# Altium project Fuel Cell Controller Board V1.PrjPcb
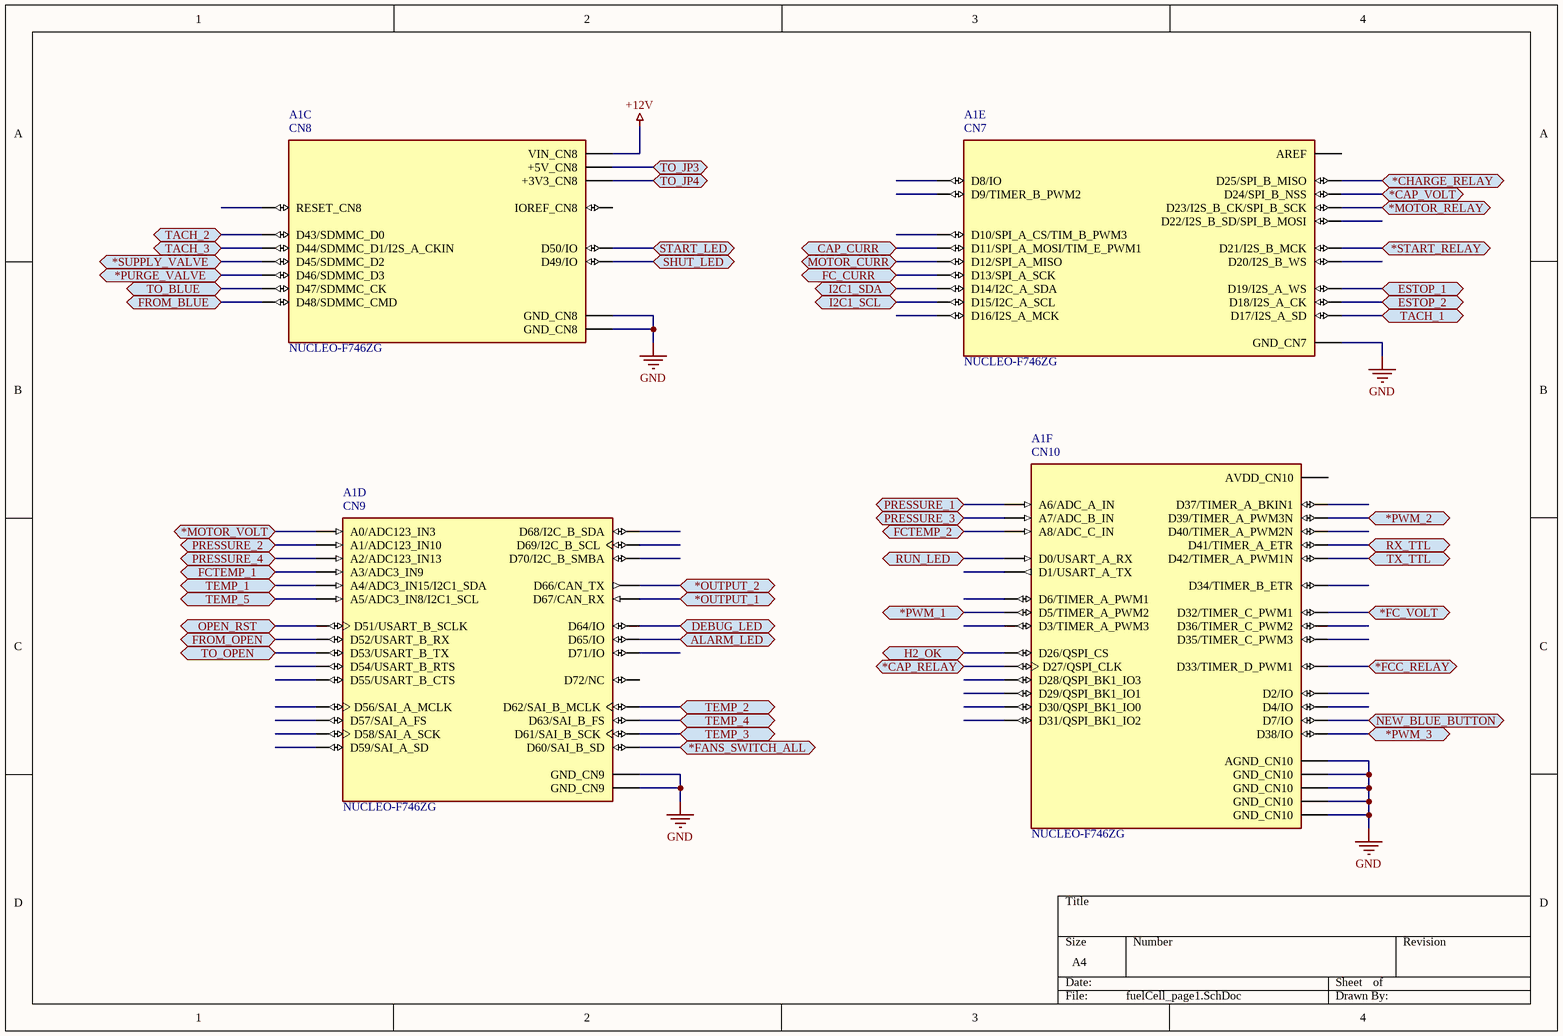
[diagram p0: fuelCell_page1.SchDoc]
2 sheets, 10 parts. Net scope: flat (ports and power ports of the same name join across sheets).
Sheets:
  fuelCell_page1.SchDoc
  fuelCell_page2.SchDoc

## Sheet fuelCell_page1.SchDoc
size A4; DrawnBy: Nicholas Semmens; SheetNumber: 1; SheetTotal: 2

### Parts
A1  NUCLEO-F746ZG  [MODULE_NUCLEO-F746ZG]  (parts C,D,E,F of 6)

### Ports
*CAP_RELAY (bidir), *CAP_VOLT (bidir), *CHARGE_RELAY (bidir), *FANS_SWITCH_ALL (bidir), *FC_VOLT (bidir), *FCC_RELAY (bidir), *MOTOR_RELAY (bidir), *MOTOR_VOLT (bidir), *OUTPUT_1 (bidir), *OUTPUT_2 (bidir), *PURGE_VALVE (bidir), *PWM_1 (bidir), *PWM_2 (bidir), *PWM_3 (bidir), *START_RELAY (bidir), *SUPPLY_VALVE (bidir), ALARM_LED (bidir), CAP_CURR (bidir), DEBUG_LED (bidir), ESTOP_1 (bidir), ESTOP_2 (bidir), FC_CURR (bidir), FCTEMP_1 (bidir), FCTEMP_2 (bidir), FROM_BLUE (bidir), FROM_OPEN (bidir), H2_OK (bidir), I2C1_SCL (bidir), I2C1_SDA (bidir), MOTOR_CURR (bidir), NEW_BLUE_BUTTON (bidir), OPEN_RST (bidir), PRESSURE_1 (bidir), PRESSURE_2 (bidir), PRESSURE_3 (bidir), PRESSURE_4 (bidir), RUN_LED (bidir), RX_TTL (bidir), SHUT_LED (bidir), START_LED (bidir), TACH_1 (bidir), TACH_2 (bidir), TACH_3 (bidir), TEMP_1 (bidir), TEMP_2 (bidir), TEMP_3 (bidir), TEMP_4 (bidir), TEMP_5 (bidir), TO_BLUE (bidir), TO_JP3 (bidir), TO_JP4 (bidir), TO_OPEN (bidir), TX_TTL (bidir)

### Nets
+12V: A1.CN8_15(VIN_CN8)
GND: A1.CN7_8(GND_CN7) A1.CN8_11(GND_CN8) A1.CN8_13(GND_CN8) A1.CN9_12(GND_CN9) A1.CN9_23(GND_CN9) A1.CN10_3(AGND_CN10) A1.CN10_5(GND_CN10) A1.CN10_17(GND_CN10) A1.CN10_22(GND_CN10) A1.CN10_27(GND_CN10)
NetA1_CN7_2: A1.CN7_2(D15/I2C_A_SCL) ; port I2C1_SCL
NetA1_CN7_3: A1.CN7_3(D17/I2S_A_SD) ; port TACH_1
NetA1_CN7_4: A1.CN7_4(D14/I2C_A_SDA) ; port I2C1_SDA
NetA1_CN7_5: A1.CN7_5(D18/I2S_A_CK) ; port ESTOP_2
NetA1_CN7_7: A1.CN7_7(D19/I2S_A_WS) ; port ESTOP_1
NetA1_CN7_10: A1.CN7_10(D13/SPI_A_SCK) ; port FC_CURR
NetA1_CN7_11: A1.CN7_11(D21/I2S_B_MCK) ; port *START_RELAY
NetA1_CN7_12: A1.CN7_12(D12/SPI_A_MISO) ; port MOTOR_CURR
NetA1_CN7_14: A1.CN7_14(D11/SPI_A_MOSI/TIM_E_PWM1) ; port CAP_CURR
NetA1_CN7_15: A1.CN7_15(D23/I2S_B_CK/SPI_B_SCK) ; port *MOTOR_RELAY
NetA1_CN7_17: A1.CN7_17(D24/SPI_B_NSS) ; port *CAP_VOLT
NetA1_CN7_19: A1.CN7_19(D25/SPI_B_MISO) ; port *CHARGE_RELAY
NetA1_CN8_2: A1.CN8_2(D43/SDMMC_D0) ; port TACH_2
NetA1_CN8_4: A1.CN8_4(D44/SDMMC_D1/I2S_A_CKIN) ; port TACH_3
NetA1_CN8_6: A1.CN8_6(D45/SDMMC_D2) ; port *SUPPLY_VALVE
NetA1_CN8_7: A1.CN8_7(+3V3_CN8) ; port TO_JP4
NetA1_CN8_8: A1.CN8_8(D46/SDMMC_D3) ; port *PURGE_VALVE
NetA1_CN8_9: A1.CN8_9(+5V_CN8) ; port TO_JP3
NetA1_CN8_10: A1.CN8_10(D47/SDMMC_CK) ; port TO_BLUE
NetA1_CN8_12: A1.CN8_12(D48/SDMMC_CMD) ; port FROM_BLUE
NetA1_CN8_14: A1.CN8_14(D49/IO) ; port SHUT_LED
NetA1_CN8_16: A1.CN8_16(D50/IO) ; port START_LED
NetA1_CN9_1: A1.CN9_1(A0/ADC123_IN3) ; port *MOTOR_VOLT
NetA1_CN9_2: A1.CN9_2(D51/USART_B_SCLK) ; port OPEN_RST
NetA1_CN9_3: A1.CN9_3(A1/ADC123_IN10) ; port PRESSURE_2
NetA1_CN9_4: A1.CN9_4(D52/USART_B_RX) ; port FROM_OPEN
NetA1_CN9_5: A1.CN9_5(A2/ADC123_IN13) ; port PRESSURE_4
NetA1_CN9_6: A1.CN9_6(D53/USART_B_TX) ; port TO_OPEN
NetA1_CN9_7: A1.CN9_7(A3/ADC3_IN9) ; port FCTEMP_1
NetA1_CN9_9: A1.CN9_9(A4/ADC3_IN15/I2C1_SDA) ; port TEMP_1
NetA1_CN9_11: A1.CN9_11(A5/ADC3_IN8/I2C1_SCL) ; port TEMP_5
NetA1_CN9_22: A1.CN9_22(D60/SAI_B_SD) ; port *FANS_SWITCH_ALL
NetA1_CN9_24: A1.CN9_24(D61/SAI_B_SCK) ; port TEMP_3
NetA1_CN9_25: A1.CN9_25(D67/CAN_RX) ; port *OUTPUT_1
NetA1_CN9_26: A1.CN9_26(D62/SAI_B_MCLK) ; port TEMP_2
NetA1_CN9_27: A1.CN9_27(D66/CAN_TX) ; port *OUTPUT_2
NetA1_CN9_28: A1.CN9_28(D63/SAI_B_FS) ; port TEMP_4
NetA1_CN9_29: A1.CN9_29(D65/IO) ; port ALARM_LED
NetA1_CN9_30: A1.CN9_30(D64/IO) ; port DEBUG_LED
NetA1_CN10_2: A1.CN10_2(D7/IO) ; port NEW_BLUE_BUTTON
NetA1_CN10_6: A1.CN10_6(D5/TIMER_A_PWM2) ; port *PWM_1
NetA1_CN10_7: A1.CN10_7(A6/ADC_A_IN) ; port PRESSURE_1
NetA1_CN10_9: A1.CN10_9(A7/ADC_B_IN) ; port PRESSURE_3
NetA1_CN10_11: A1.CN10_11(A8/ADC_C_IN) ; port FCTEMP_2
NetA1_CN10_13: A1.CN10_13(D26/QSPI_CS) ; port H2_OK
NetA1_CN10_15: A1.CN10_15(D27/QSPI_CLK) ; port *CAP_RELAY
NetA1_CN10_16: A1.CN10_16(D0/USART_A_RX) ; port RUN_LED
NetA1_CN10_18: A1.CN10_18(D42/TIMER_A_PWM1N) ; port TX_TTL
NetA1_CN10_20: A1.CN10_20(D41/TIMER_A_ETR) ; port RX_TTL
NetA1_CN10_26: A1.CN10_26(D39/TIMER_A_PWM3N) ; port *PWM_2
NetA1_CN10_28: A1.CN10_28(D38/IO) ; port *PWM_3
NetA1_CN10_29: A1.CN10_29(D32/TIMER_C_PWM1) ; port *FC_VOLT
NetA1_CN10_31: A1.CN10_31(D33/TIMER_D_PWM1) ; port *FCC_RELAY

Not connected (* = marked no-connect by the designer): A1 CN7_1(D16/I2S_A_MCK) CN7_6(AREF) CN7_9(D20/I2S_B_WS) CN7_13(D22/I2S_B_SD/SPI_B_MOSI) CN7_16(D10/SPI_A_CS/TIM_B_PWM3) CN7_18(D9/TIMER_B_PWM2) CN7_20(D8/IO) CN8_3(IOREF_CN8) CN8_5(RESET_CN8) CN9_8(D54/USART_B_RTS) CN9_10(D55/USART_B_CTS) CN9_13(D72/NC) CN9_14(D56/SAI_A_MCLK) CN9_15(D71/IO) CN9_16(D57/SAI_A_FS) CN9_17(D70/I2C_B_SMBA) CN9_18(D58/SAI_A_SCK) CN9_19(D69/I2C_B_SCL) CN9_20(D59/SAI_A_SD) CN9_21(D68/I2C_B_SDA) CN10_1(AVDD_CN10) CN10_4(D6/TIMER_A_PWM1) CN10_8(D4/IO) CN10_10(D3/TIMER_A_PWM3) CN10_12(D2/IO) CN10_14(D1/USART_A_TX) CN10_19(D28/QSPI_BK1_IO3) CN10_21(D29/QSPI_BK1_IO1) CN10_23(D30/QSPI_BK1_IO0) CN10_24(D40/TIMER_A_PWM2N) CN10_25(D31/QSPI_BK1_IO2) CN10_30(D37/TIMER_A_BKIN1) CN10_32(D36/TIMER_C_PWM2) CN10_33(D34/TIMER_B_ETR) CN10_34(D35/TIMER_C_PWM3)

### Notes on the sheet
- (in symbol NUCLEO-F746ZG, part C) CN8
- (in symbol NUCLEO-F746ZG, part D) CN9
- (in symbol NUCLEO-F746ZG, part E) CN7
- (in symbol NUCLEO-F746ZG, part F) CN10

### Library data of the parts
A1 = NUCLEO-F746ZG: STM32F746ZG, mbed-Enabled Development Nucleo-144 STM32F7 ARMÂ® CortexÂ®-M7 MCU 32-Bit Embedded Evaluation Board; MF: STMicroelectronics; SnapEDA_Link: https://www.snapeda.com/parts/NUCLEO-F746ZG/STMicroelectronics/view-part/531935/?ref=snap; Price: None; Check_prices: https://www.snapeda.com/parts/NUCLEO-F746ZG/STMicroelectronics/view-part/531935/?ref=eda; Value: *; Package: None; Availability: Warning; Purchase-URL: https://pricing.snapeda.com/search/part/NUCLEO-F746ZG/?ref=eda; MP: NUCLEO-F746ZG

## Sheet fuelCell_page2.SchDoc
size A4; SheetNumber: 2; SheetTotal: 2
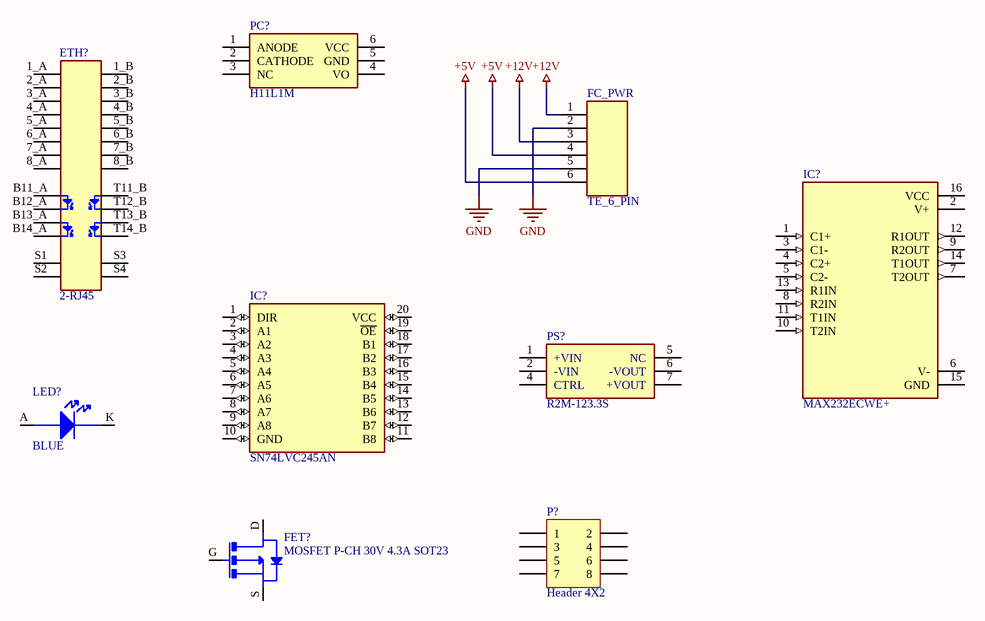
[diagram p1: fuelCell_page2.SchDoc]

### Parts
(Parts that share a designator on the sheet are numbered #1, #2 ... from top to bottom, then left to right.)
ETH?  2-RJ45  [RJ45]
FC_PWR  TE_6_PIN  [TE_6_PIN]
FET?  MOSFET P-CH 30V 4.3A SOT23  [MOSFET P-CH 30V 4.3A SOT23]
IC?#1  MAX232ECWE+  [MAX232ECWE+]
IC?#2  SN74LVC245AN  [SN74LVC245AN]
LED?  BLUE  [LED]
P?  Header 4X2  [HDR2X4]
PC?  H11L1M  [H11L1M]
PS?  R2M-123.3S  [R2M-123.3S]

### Nets
+5V: FC_PWR.4 FC_PWR.6
+12V: FC_PWR.1 FC_PWR.3
GND: FC_PWR.2 FC_PWR.5

Not connected (* = marked no-connect by the designer): ETH? 1_A(+) 1_B(SHIELD) 2_A(+) 2_B(SHIELD) 3_A(+) 3_B(SHIELD) 4_A(+) 4_B(SHIELD) 5_A(+) 5_B(SHIELD) 6_A(+) 6_B(SHIELD) 7_A(+) 7_B(SHIELD) 8_A(+) 8_B(SHIELD) B11_A(9) B12_A(10) B13_A(11) B14_A(12) S1(13) S2(13) S3(SHIELD) S4(SHIELD) T11_B(SHIELD) T12_B(SHIELD) T13_B(B13_B) T14_B(SHIELD); FET? D G S; IC?#1 1(C1+) 2(V+) 3(C1-) 4(C2+) 5(C2-) 6(V-) 7(T2OUT) 8(R2IN) 9(R2OUT) 10(T2IN) 11(T1IN) 12(R1OUT) 13(R1IN) 14(T1OUT) 15(GND) 16(VCC); IC?#2 1(DIR) 2(A1) 3(A2) 4(A3) 5(A4) 6(A5) 7(A6) 8(A7) 9(A8) 10(GND) 11(B8) 12(B7) 13(B6) 14(B5) 15(B4) 16(B3) 17(B2) 18(B1) 19(~{OE}) 20(VCC); LED? A(S) K(S); P? 1 2 3 4 5 6 7 8; PC? 1(SHIELD) 2(SHIELD) 3(SHIELD) 4(SHIELD) 5(SHIELD) 6(SHIELD); PS? 1(+VIN) 2(S) 4(S) 5(S) 6(S) 7(S)

### Notes on the sheet
- (in symbol H11L1M) ANODE; VCC; CATHODE; GND; NC; VO
- (in symbol R2M-123.3S) NC; -VIN; -VOUT; CTRL; +VOUT

### Library data of the parts
ETH? = 2-RJ45: Jack Modular Connector 8p8c (RJ45, Ethernet) 90° Angle (Right) Shielded, EMI Finger Cat5; ComponentLink1Description: Mouser Part; ComponentLink1URL: https://www.mouser.ca/ProductDetail/TRP-Connector-Bel/1840855-3?qs=SRYZG9HaIQ2NEIyvH9raPA%3D%3D
FET? = MOSFET P-CH 30V 4.3A SOT23: P-Channel 30 V 4.3A (Ta) 1.38W (Ta) Surface Mount SOT-23-3
IC?#1 = MAX232ECWE+: RS-232 Interface IC +/-15kV ESD-Protected, +5V RS-232 Transceivers
IC?#2 = SN74LVC245AN: Bus Transceivers Tri-State Octal Bus
LED? = LED
P? = Header 4X2: Header, 4-Pin, Dual row; LatestRevisionDate: 17-Jul-2002; LatestRevisionNote: Re-released for DXP Platform.; Publisher: Altium Limited
PC? = H11L1M: Logic Output Optocouplers Optocoupler LC Schmitt Trigger
PS? = R2M-123.3S: Isolated DC/DC Converters - Through Hole 2W 4.5-18Vin 3.3Vout 500mA

## Nets that join several sheets
+12V: fuelCell_page1 (A1.CN8_15), fuelCell_page2 (FC_PWR.1 FC_PWR.3)
GND: fuelCell_page1 (10 pins), fuelCell_page2 (FC_PWR.2 FC_PWR.5)